# EAGLE design SGP40 Breakout (EAGLE 9.6.2)
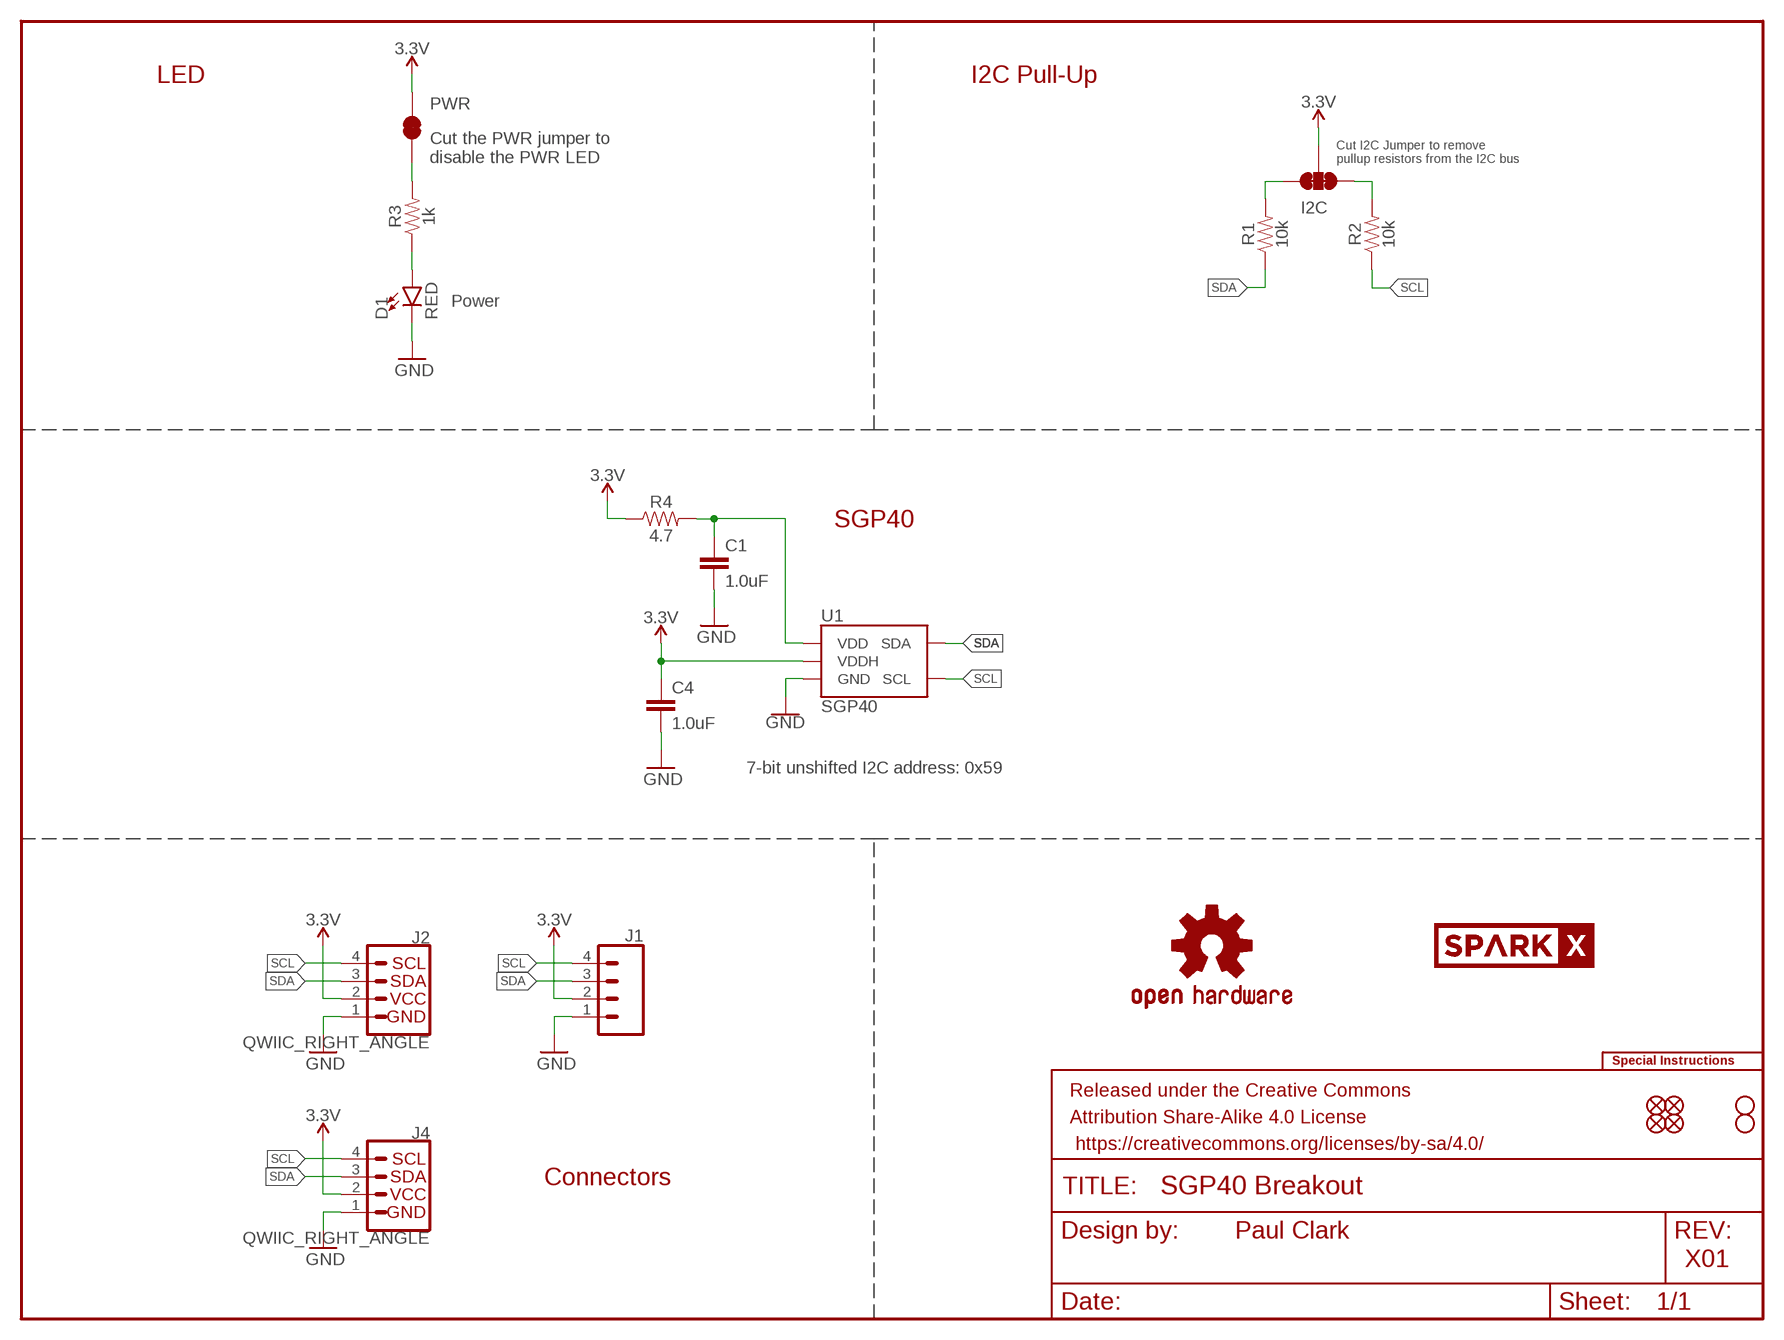
[diagram p0: schematic, sheet 1]

## Parts
C1  1.0uF  1.0UF-0603-16V-10%-X7R  [0603]
C4  1.0uF  1.0UF-0603-16V-10%-X7R  [0603]
D1  RED  LED-RED0603  [LED-0603]
FRAME1  FRAME-LETTER  [CREATIVE_COMMONS]
I2C  JUMPER-SMT_3_2-NC_TRACE_SILK  [SMT-JUMPER_3_2-NC_TRACE_SILK]
J1  CONN_041X04_NO_SILK  [1X04_NO_SILK]
J2  QWIIC_RIGHT_ANGLE  QWIIC_CONNECTORJS-1MM  [JST04_1MM_RA]
J4  QWIIC_RIGHT_ANGLE  QWIIC_CONNECTORJS-1MM  [JST04_1MM_RA]
JP1  FIDUCIAL1X2  [FIDUCIAL-1X2]
JP2  FIDUCIAL1X2  [FIDUCIAL-1X2]
JP3  STAND-OFF  [STAND-OFF]
JP4  STAND-OFF  [STAND-OFF]
JP5  FIDUCIAL1X2  [FIDUCIAL-1X2]
JP6  FIDUCIAL1X2  [FIDUCIAL-1X2]
LOGO1  SPECIAL_INSTRUCTIONS-ORDERING  [ORDERING_INSTRUCTIONS]
LOGO5  OSHW-LOGOS  [OSHW-LOGO-S]
PWR  JUMPER-SMT_2_NC_TRACE_SILK  [SMT-JUMPER_2_NC_TRACE_SILK]
R1  10k  10KOHM-0603-1/10W-1%  [0603]
R2  10k  10KOHM-0603-1/10W-1%  [0603]
R3  1k  1KOHM-0603-1/10W-1%  [0603]
R4  4.7  4.7OHM-0603-1/10W-1%  [0603]
U1  SGP40  [SGP40]
U$10  SPARKX-LOGO3  [SPARKX-SMALL]
U$18  SPARKX-LOGO3  [SPARKX-SMALL]

## Nets
3.3V: C4.1 I2C.2 J1.2 J2.2 J4.2 PWR.2 R4.1 U1.5(VDDH)
GND: C1.2 C4.2 D1.C J1.1 J2.1 J4.1 U1.2(GND) U1.4(GND) U1.DIEPAD(GND)
N$1: PWR.1 R3.2
N$2: I2C.3 R1.2
N$3: D1.A R3.1
N$4: I2C.1 R2.2
N$5: C1.1 R4.2 U1.1(VDD)
SCL: J1.4 J2.4 J4.4 R2.1 U1.6(SCL)
SDA: J1.3 J2.3 J4.3 R1.1 U1.3(SDA)

## Notes on the sheet
- LED | I2C Pull-Up
- Cut the PWR jumper to
  disable the PWR LED
- Cut I2C Jumper to remove 
  pullup resistors from the I2C bus
- Power
- SGP40
- 7-bit unshifted I2C address: 0x59
- Connectors
- Paul Clark
- X01

## Library data of the parts
C1 C4 = SparkFun-Capacitors:1.0UF: 1µF ceramic capacitors A capacitor is a passive two-terminal electrical component used to store electrical energy temporarily in an electric field.; PROD_ID: CAP-13930
D1 = SparkFun-LED:LED-RED: Red SMD LED Used in manufacturing of most products at SparkFun Packages: 0603 - SMD 0603 package [Product Link] <http://docs.avagotech.com/docs/AV02-0551EN> 0603 SMART - SMD 0603 SMART package ( more efficient and expensive)[Product Link] <http://www.osram-os.com/Graphics/XPic2/00077099_0.pdf> 1206 - SMD1206 package [Product Link] <https://www.sparkfun.com/datasheets/DevTools/LilyPad/Q150OVS4.pdff> SparkFun Products: Pro Mini 328 -5V <https://www.sparkfun.com/products/821> RedBoard <https://www.sparkfun.com/products/12757> IOIO-OTG <https://www.sparkfun.com/products/13613>; PROD_ID: DIO-00819
FRAME1 = SparkFun-Aesthetics:FRAME-LETTER: Schematic Frame - Letter Standard 8.5x11 US Letter frame
I2C = SparkFun-Jumpers:JUMPER-SMT_3_2-NC_TRACE: Normally closed trace jumper (2 of 2 connections) This jumper has a trace between all three pads so they are normally closed (NC). Use a razor knife to open the connection(s). For best results follow the IPC guidelines for cutting traces: Cutout at least 0.063 mm (0.005 in). Remove all loose material to clean up the cut area. Seal the cut with an approved epoxy. Reapply solder to reclose the connection(s).
J1 = SparkFun-Connectors:CONN_04: Multi connection point. Often used as Generic Header-pin footprint for 0.1 inch spaced/style header connections On any of the 0.1 inch spaced packages, you can populate with these: Break Away Headers - Straight <https://www.sparkfun.com/products/116> (PRT-00116) Break Away Male Headers - Right Angle <https://www.sparkfun.com/products/553> (PRT-00553) Female Headers <https://www.sparkfun.com/products/115> (PRT-00115) Break Away Headers - Machine Pin <https://www.sparkfun.com/products/117> (PRT-00117) Break Away Female Headers - Swiss Machine Pin <https://www.sparkfun.com/products/743> (PRT-00743) For SCREWTERMINALS and SPRING TERMINALS visit here: Screw Terimnals on SparkFun.com <https://www.sparkfun.com/search/results?term=Screw+Terminals> (5mm/3.5mm/2.54mm spacing) This device is also useful as a general connection point to wire up your design to another part of your project. Our various solder wires solder well into these plated through hole pads. Hook-Up Wire - Assortment (Stranded, 22 AWG) <https://www.sparkfun.com/products/11375> (PRT-11375) Hook-Up Wire - Assortment (Solid Core, 22 AWG) <https://www.sparkfun.com/products/11367> (PRT-11367) View the entire wire category on our website here <https://www.sparkfun.com/categories/141> Special notes: Molex polarized connector foot print use with SKU : PRT-08231 with associated crimp pins and housings. 1MM SMD Version SKU: PRT-10208; PROD_ID: CONN-09696
J2 J4 = SparkFun-Connectors:QWIIC_CONNECTOR: SparkFun I2C Standard Qwiic Connector An SMD 1mm pitch JST connector makes it easy and quick (get it? Qwiic?) to connect I2C devices to each other. The Qwiic system <http://www.sparkfun.com/qwiic> enables fast and solderless connection between popular platforms and various sensors and actuators. We carry 200mm <https://www.sparkfun.com/products/14204>, 100mm <https://www.sparkfun.com/products/14205>, 50mm <https://www.sparkfun.com/products/14206>, and breadboard friendly <https://www.sparkfun.com/products/14207> Qwiic cables. We also offer 10 pcs strips <https://www.sparkfun.com/products/14323> the SMD connectors.; PROD_ID: CONN-13694
JP1 JP2 JP5 JP6 = SparkFun-Aesthetics:FIDUCIAL: Fiducial Alignment Points Point-of-reference for pick-and-place machines and other optical instruments.
JP3 JP4 = SparkFun-Hardware:STAND-OFF: Stand Off Drill holes for mechanically mounting via screws, standoffs, etc. Note: Use the keepout ring to avoid running the screw head into surrounding components. Variant Overviews STAND-OFF - Mechanical footprint for a #4 phillips button head screw. STAND-OFF-TIGHT - Mechanical footprint for a #4 phillips button head screw, Example SparkFun Products Screw - Phillips Head (1/4", 4-40, 10 pack) <https://www.sparkfun.com/products/10453> (PRT-10453) Screw - Phillips Head (1/2", 4-40, 10 pack) <https://www.sparkfun.com/products/10452> (PRT-10452) Screw - Phillips Head (3/4", 4-40, 10 pack) <https://www.sparkfun.com/products/10451> (PRT-10451) Screw - Phillips Head (1", 4-40, 10 pack) <https://www.sparkfun.com/products/10450> (PRT-10450)
LOGO1 = SparkFun-Aesthetics:SPECIAL_INSTRUCTIONS: Special Ordering/Production Instructions Alert Symbol for special PCB ordering instructions or unique production process warnings. Ordering Instructions Production Instructions Types of information that should be added to box: Copper weight Soldermask color Silk color PCB thickness Number of layers PCB Standard: 1.6mm FR4 1 oz copper immersion silver plating red soldermask white silkscreen Types of information that should be added to box: Special wash requirements Depaneling instructions Humidification Glue curing Default text settings: 0.07 inch 9% ratio 50% line distance
LOGO5 = SparkFun-Aesthetics:OSHW-LOGO: Open-Source Hardware (OSHW) Logo This logo indicates the piece of hardware it is found on incorporates a OSHW license and/or adheres to the definition of open source hardware found here: http://freedomdefined.org/OSHW
PWR = SparkFun-Jumpers:JUMPER-SMT_2_NC_TRACE: Normally closed trace jumper This jumper has a trace between two pads so it's normally closed (NC). Use a razor knife to open the connection. For best results follow the IPC guidelines for cutting traces: Cutout at least 0.063 mm (0.005 in). Remove all loose material to clean up the cut area. Seal the cut with an approved epoxy. Reapply solder to reclose the connection.
R1 R2 = SparkFun-Resistors:10KOHM: 10kΩ resistor A resistor is a passive two-terminal electrical component that implements electrical resistance as a circuit element. Resistors act to reduce current flow, and, at the same time, act to lower voltage levels within circuits. - Wikipedia; PROD_ID: RES-00824
R3 = SparkFun-Resistors:1KOHM: 1kΩ resistor A resistor is a passive two-terminal electrical component that implements electrical resistance as a circuit element. Resistors act to reduce current flow, and, at the same time, act to lower voltage levels within circuits. - Wikipedia; PROD_ID: RES-07856
R4 = SparkFun-Resistors:4.7OHM: 4.7Ω resistor A resistor is a passive two-terminal electrical component that implements electrical resistance as a circuit element. Resistors act to reduce current flow, and, at the same time, act to lower voltage levels within circuits. - Wikipedia; PROD_ID: RES-15581
U1 = SparkFun-Sensors:SGP40: The SGP40 is a digital gas sensor designed for easy integration into air purifiers or demand-controlled ventilation systems.; DIGIKEY_PART: 1649-SGP40-D-R4CT-ND; PROD_ID: IC-15580
U$10 U$18 = SparkX:SPARKX-LOGO

## Net classes
1 power: width 0.203 mm

## Board
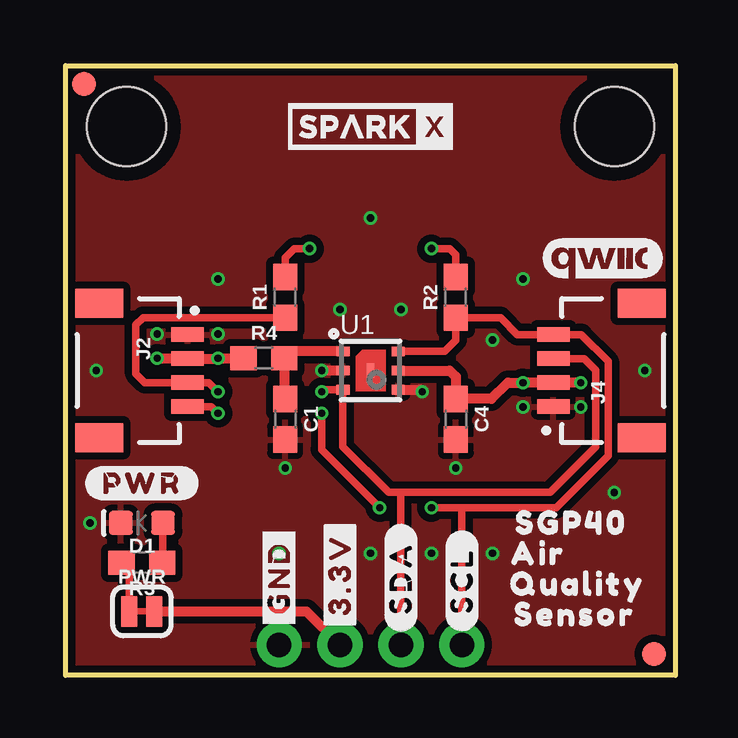
[diagram p1: board, top side]
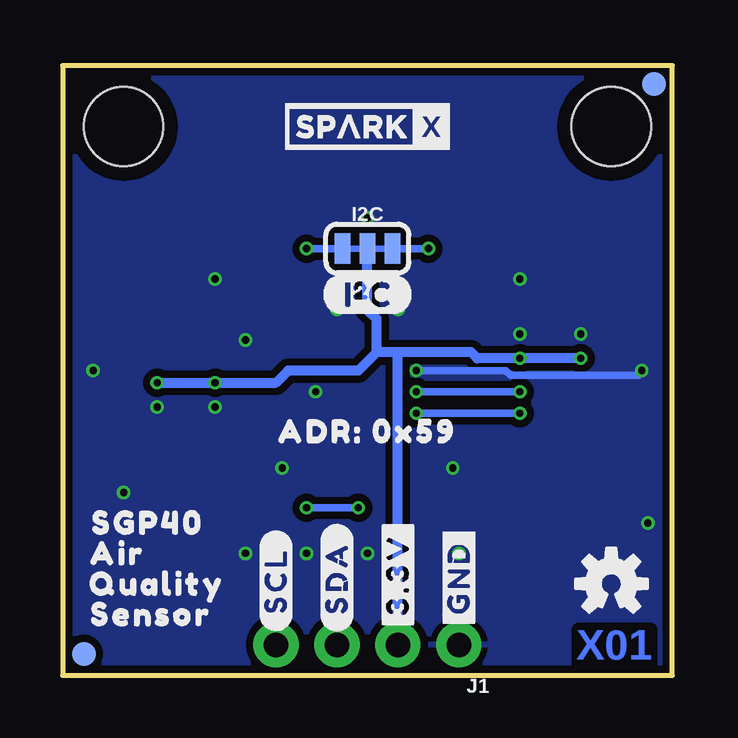
[diagram p2: board, bottom side, seen from below]

Size 25.4 x 25.4 mm. Coordinates in mm from the lower left corner, seen from the top.
Outline: 0,0 0,25.4 25.4,25.4 25.4,0 0,0
Copper layers (1*16): Top 0.035mm / dielectric 1.5mm / Bottom 0.035mm
Design rules "SparkFun-2-Layer-Minimum-JLCPCB": minimum track width 5mil, minimum drill 0.3mm, track to track 5mil, track to pad 5mil, pad to pad 5mil, via to via 5mil, smd to smd 5mil, copper to edge 7mil, drill to drill 7mil, minimum pad ring 5mil, minimum via ring 5mil, stop-mask expansion 2.5mil, vias tented up to drill 25mil, thermal gap 10mil

### Footprints (pad centres in the part's own frame; a part is rotated, then mirrored left to right if it is on the bottom)
0603 = smd 1.1 x 1: 1 -0.85,0; 2 0.85,0
LED-0603 = smd 1 x 1: A -0.877,0; C 0.877,0
SMT-JUMPER_3_2-NC_TRACE_SILK = smd 0.66 x 1.27: 1 -1.041,0; 2 0,0; 3 1.041,0
1X04_NO_SILK = drill 1.016 pad 1.88: 1 0,0; 2 2.54,0; 3 5.08,0; 4 7.62,0
JST04_1MM_RA = smd 0.6 x 1.35: 1 -1.5,0; 2 -0.5,0; 3 0.5,0; 4 1.5,0 | smd 1.2 x 2: NC1 2.8,-3.675; NC2 -2.8,-3.675
FIDUCIAL-1X2 = smd 1 x 1: 1 0,0
STAND-OFF = hole 3.302: 0,0
SMT-JUMPER_2_NC_TRACE_SILK = smd 0.66 x 1.27: 1 -0.521,0; 2 0.521,0
SGP40 = smd 0.55 x 0.4: 1 -1.15,0.8; 2 -1.15,0; 3 -1.15,-0.8; 4 1.15,-0.8; 5 1.15,0; 6 1.15,0.8 | smd 0.305 x 0.61: DIEPAD 0,0

### Placement (x,y rotation side)
C1  9.14,10.67 270 top
C4  16.26,10.67 270 top
D1  3.17,6.35 180 top
FRAME1  45.72,-10.16 0 top  (outside the outline)
I2C  12.7,17.78 0 bottom
J1  8.89,1.27 180 bottom
J2  5.08,12.7 270 top
J4  20.32,12.7 90 top
JP1  0.76,24.64 0 bottom
JP2  24.51,0.89 0 top
JP3  2.54,22.86 0 top
JP4  22.86,22.86 0 top
JP5  24.51,0.89 0 bottom
JP6  0.76,24.64 0 top
LOGO1  30.48,50.8 0 top  (outside the outline)
LOGO5  2.54,3.81 0 bottom
PWR  3.17,2.67 0 top
R1  9.14,15.75 90 top
R2  16.26,15.75 90 top
R3  3.17,4.7 180 top
R4  8.26,13.21 0 top
U1  12.7,12.7 0 top
U$1  [#GND#0]  8.89,4.06 90 bottom
U$2  [#3#3V#0]  11.43,4.19 90 bottom
U$3  [#SDA#0]  13.97,4.06 90 bottom
U$4  [#SCL#0]  16.51,3.94 90 bottom
U$10  12.7,22.86 0 top
U$15  [I2C]  14.61,15.88 0 bottom
U$16  [QWIIC_5MM]  22.35,17.4 0 top
U$18  12.7,22.86 0 bottom
U$19  [SGP400]  21.08,6.35 0 top
U$20  [SGP400]  21.84,6.35 0 bottom
U$23  [AIR0]  19.68,5.08 0 top
U$24  [AIR0]  23.11,5.08 0 bottom
U$25  [QUALITY0]  21.34,3.81 0 top
U$28  [QUALITY0]  21.46,3.81 0 bottom
U$29  [SENSOR0]  21.21,2.54 0 top
U$30  [SENSOR0]  21.72,2.54 0 bottom
U$31  [ADR#_0X590]  12.7,10.16 0 bottom
U$32  [#PWR#0]  3.17,8 0 top
U$33  [#GND#0]  8.89,4.06 90 top
U$34  [#3#3V#0]  11.43,4.19 90 top
U$35  [#SDA#0]  13.97,4.06 90 top
U$36  [#SCL#0]  16.51,3.94 90 top

### Tracks (layer width: path | path; a pad name or v marks a point on that pad's centre or on a via)
3.3V  (via drill 0.3)
  Top 0.406: U1.5 16,12.7 16.26,12.45 C4.1 17.74,11.52 18.42,12.2 v19.04,12.2 | v3.81,13.21 v3.82,13.2 J2.2 v6.34,13.2 | PWR.2 10.03,2.67 J1.2 | v6.34,13.2 v6.35,13.21 | R4.1 7.4,13.2 v6.34,13.2 | v19.04,12.2 v19.05,12.19 | v19.04,12.2 J4.2 v21.46,12.19
  Bottom 0.406: 11.43,13.46 8.38,13.46 8.13,13.21 v6.35,13.21 v3.81,13.21 | 11.43,13.46 12.32,13.46 | 12.32,13.46 13.08,12.7 16,12.7 16.51,12.19 v19.05,12.19 v21.46,12.19 | J1.2 11.43,13.46 | 12.32,13.46 12.32,14.86 12.7,15.24 I2C.2
GND  (via drill 0.3)
  Top 0.406: U1.2 v10.67,12.7 | U1.4 14.77,11.9 v14.86,11.81
  Bottom 0.305: v10.67,12.7 6.93,12.7 6.74,12.51 1.39,12.51 1.27,12.63 v1.27,12.7
  other vias: 1.02,6.35 9.14,8.64 16.26,8.64 21.46,11.18 19.05,11.18 6.35,14.22 3.81,14.22 6.35,16.51 19.05,16.51 17.78,5.08 22.86,7.62 24.13,12.7 15.24,5.08 12.7,5.08 8.89,5.08 11.43,15.24 13.97,15.24 12.7,19.05 17.78,13.97
  pour Bottom (isolate 0.305): 0,0 0,25.4 25.4,25.4 25.4,0
  pour Top (isolate 0.305): 0,0 0,25.4 25.4,25.4 25.4,0
N$1
  Top 0.305: PWR.1 2.65,4.37 R3.2
N$2  (via drill 0.3)
  Top 0.305: R1.2 9.14,17.4 9.53,17.78 v10.16,17.78
  Bottom 0.305: v10.16,17.78 I2C.3
N$3
  Top 0.305: D1.A 4.05,4.73 R3.1
N$4  (via drill 0.3)
  Top 0.305: R2.2 16.26,17.53 16,17.78 v15.24,17.78
  Bottom 0.305: v15.24,17.78 I2C.1
N$5
  Top 0.406: C1.1 9.11,11.56 R4.2 9.4,13.5 U1.1
SCL  (via drill 0.3)
  Top 0.305: U1.6 15.79,13.5 16.26,13.97 R2.1 18.12,14.9 18.82,14.2 J4.4 21.49,14.2 22.61,13.08 22.61,9.14 20.45,6.99 16.51,6.99 | J2.4 6.07,11.2 v6.35,10.92 | v10.67,10.92 10.67,9.4 v13.08,6.99 | v15.24,6.99 16.51,6.99 | 16.51,6.99 J1.4
  Bottom 0.305: v10.67,10.92 v6.35,10.92 | v15.24,6.99 v13.08,6.99
SDA  (via drill 0.3)
  Top 0.305: v6.35,11.81 5.96,12.2 J2.3 3.29,12.2 2.92,12.57 2.92,14.61 3.22,14.91 R1.1 | v10.67,11.81 10.76,11.9 U1.3 11.55,9.53 13.46,7.62 13.97,7.62 | J4.3 21.6,13.2 22.09,12.7 22.09,9.52 20.19,7.62 13.97,7.62 | J1.3 13.97,7.62
  Bottom 0.305: v10.67,11.81 v6.35,11.81

### Text on the board
Bottom: X01
Measures: Dimensions in inches
tDocu: 2 Layers / 1.6mm Thickness / HASL Finish | Paul Clark